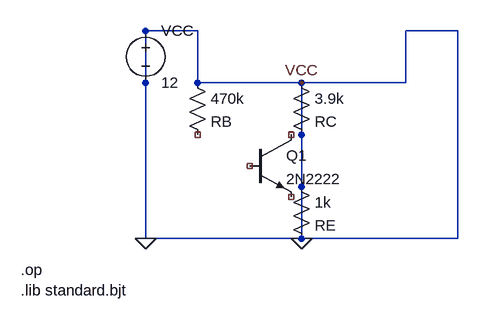
[diagram p0: schematic emetteur_commun.asc]
emetteur_commun.asc, the LTspice schematic file:
Version 4
SHEET 1 1000 800
WIRE 240 80 160 80
WIRE 160 80 160 400
WIRE 240 80 240 160
WIRE 560 80 560 160
WIRE 560 80 640 80
WIRE 640 80 640 400
WIRE 160 400 640 400
WIRE 400 160 400 240
WIRE 240 160 400 160
WIRE 400 160 560 160
WIRE 400 240 400 320
WIRE 400 320 400 400
FLAG 160 400 0
FLAG 400 160 VCC
FLAG 400 400 0
SYMBOL voltage 160 64 R0
WINDOW 123 0 0 Left 0
WINDOW 39 0 0 Left 0
SYMATTR InstName VCC
SYMATTR Value 12
SYMBOL res 224 144 R0
WINDOW 0 36 76 Left 2
WINDOW 3 36 40 Left 2
SYMATTR InstName RB
SYMATTR Value 470k
SYMBOL res 384 144 R0
WINDOW 0 36 76 Left 2
WINDOW 3 36 40 Left 2
SYMATTR InstName RC
SYMATTR Value 3.9k
SYMBOL res 384 304 R0
WINDOW 0 36 76 Left 2
WINDOW 3 36 40 Left 2
SYMATTR InstName RE
SYMATTR Value 1k
SYMBOL npn 320 240 R0
SYMATTR InstName Q1
SYMATTR Value 2N2222
TEXT -32 448 Left 2 !.op
TEXT -32 480 Left 2 !.lib standard.bjt

The netlist it stands for:
* emetteur_commun.asc
VCC 0 0 12
RB 0 NC_01 470k
RC 0 0 3.9k
RE 0 0 1k
Q1 NC_02 NC_03 NC_04 0 2N2222
.model NPN NPN
.model PNP PNP
.lib standard.bjt
.op
.lib standard.bjt
.backanno
.end